# EAGLE design pc_OpenOx-ESP32_v1.1 (EAGLE 9.5.2)
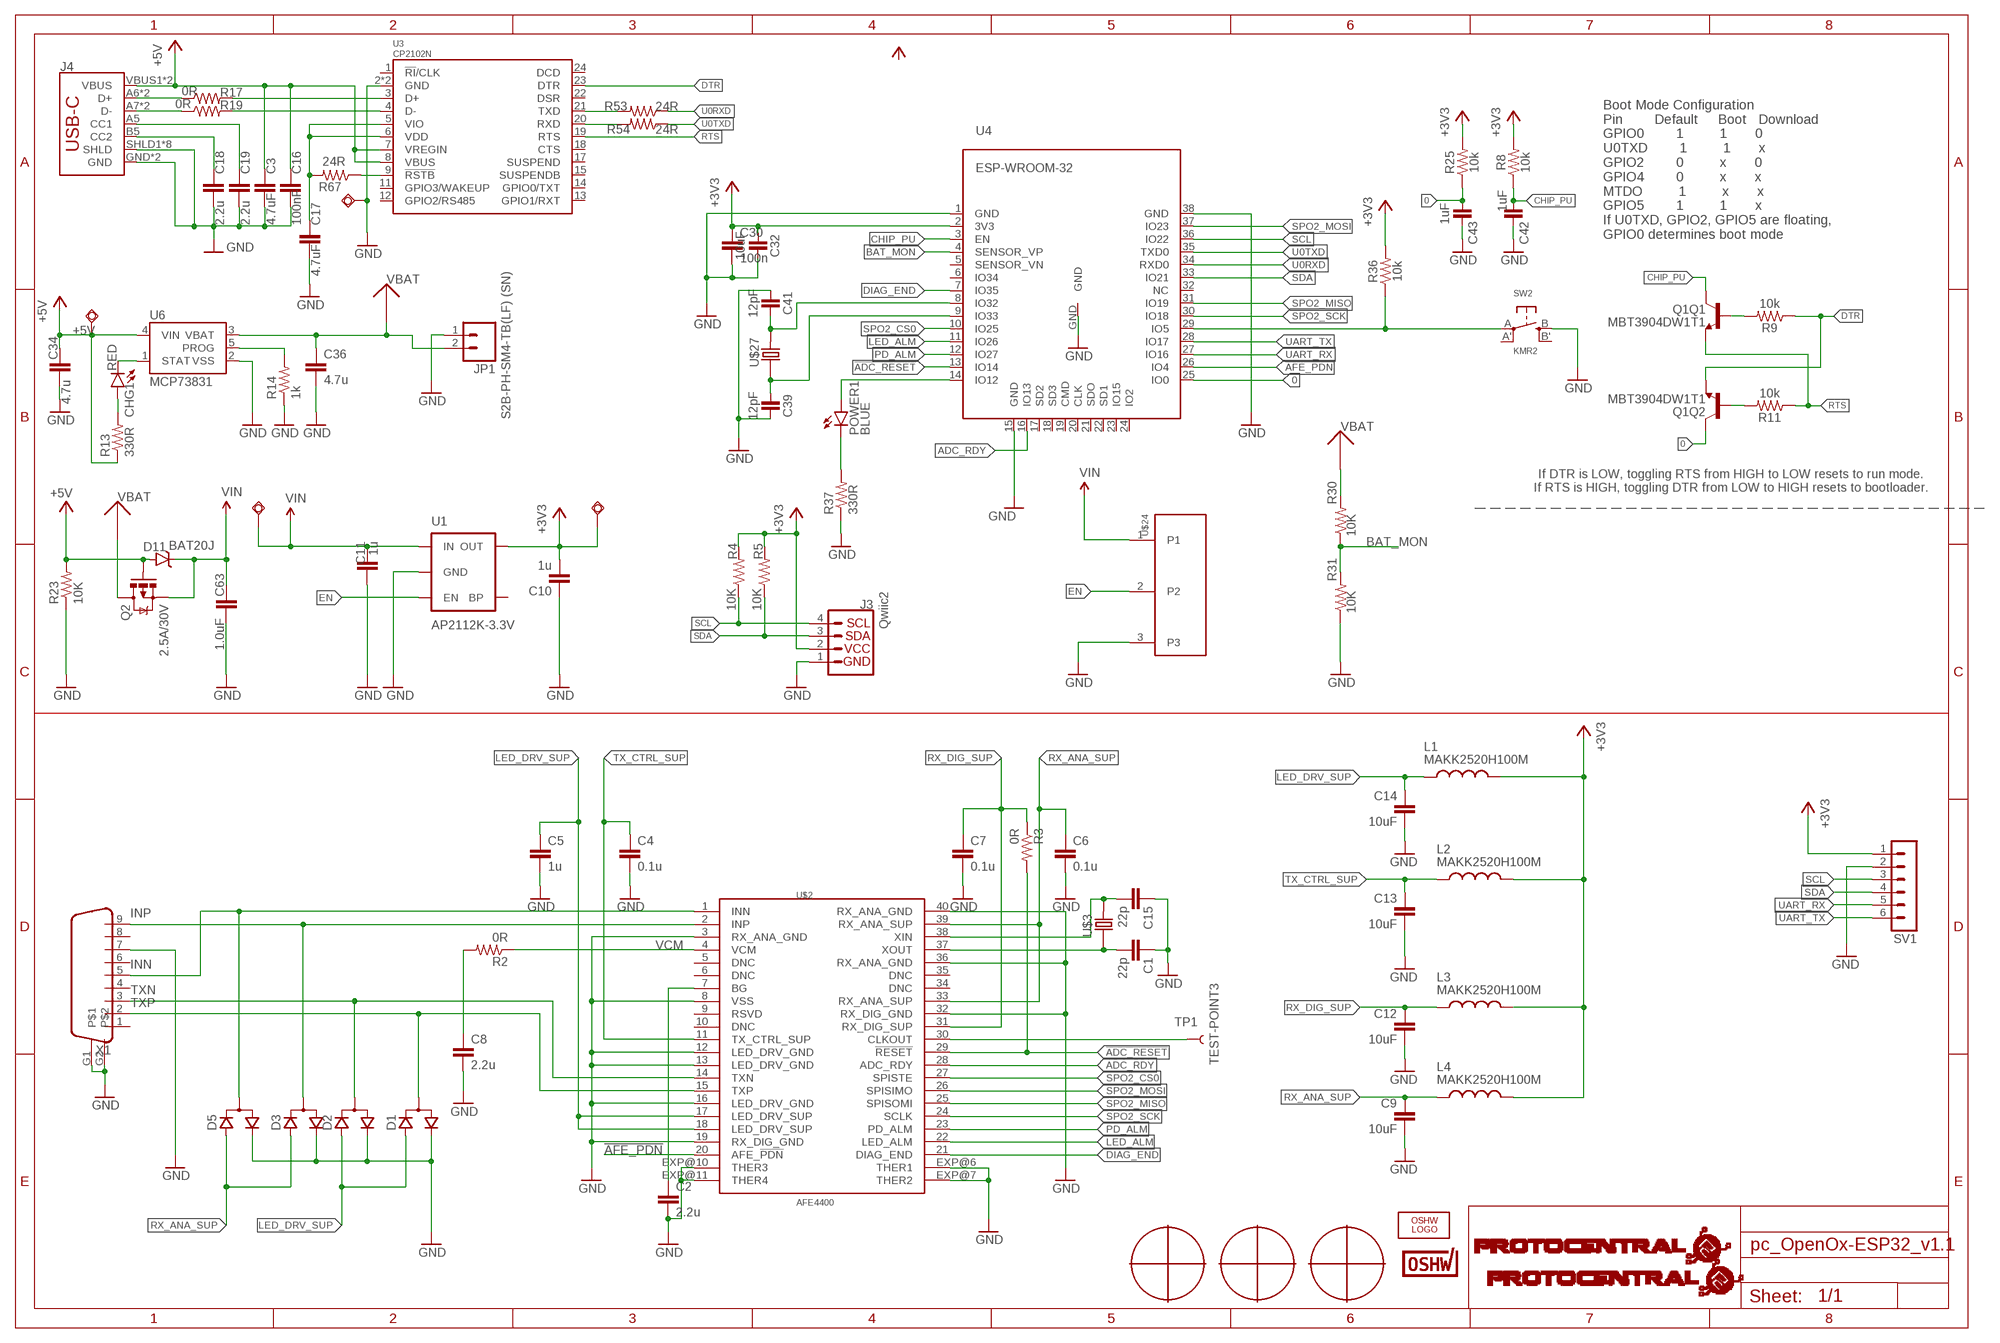
[diagram p0: schematic, sheet 1]

## Parts
C1  22p  C-EUC0402  [C0402]
C2  2.2u  C-EUC0402  [C0402]
C3  4.7uF  C-EUC0402  [C0402]
C4  0.1u  C-EUC0805  [C0805]
C5  1u  C-EUC0805  [C0805]
C6  0.1u  C-EUC0805  [C0805]
C7  0.1u  C-EUC0805  [C0805]
C8  2.2u  C-EUC0402  [C0402]
C9  10uF  C-EUC0805  [C0805]
C10  1u  C-EUC0805  [C0805]
C11  1u  C-EUC0805  [C0805]
C12  10uF  C-EUC0805  [C0805]
C13  10uF  C-EUC0805  [C0805]
C14  10uF  C-EUC0805  [C0805]
C15  22p  C-EUC0402  [C0402]
C16  100nF  C-EUC0402  [C0402]
C17  4.7uF  C-EUC0402  [C0402]
C18  2.2u  C-EUC0402  [C0402]
C19  2.2u  C-EUC0402  [C0402]
C30  100n  C-EUC0805  [C0805]
C32  10uF  CAPACITORS-0805  [C0805]
C34  4.7u  C-EUC0805  [C0805]
C36  4.7u  C-EUC0805  [C0805]
C39  12pF  CAPACITORS-0402  [C0402]
C41  12pF  CAPACITORS-0402  [C0402]
C42  1uF  CAPACITORS-0402  [C0402]
C43  1uF  CAPACITORS-0402  [C0402]
C63  1.0uF  C-EUC0402  [C0402]
CHG1  RED  LEDCHIPLED_0603  [CHIPLED_0603]
D1  D_ACACSOT323  [SOT323]
D2  D_ACACSOT323  [SOT323]
D3  D_ACACSOT323  [SOT323]
D5  D_ACACSOT323  [SOT323]
D11  BAT20J  DIODE-SCHOTTKY-BAT20J  [SOD-323]
J3  Qwiic2  QWIIC_CONNECTORJS-1MM  [1X04_1MM_RA]
J4  USB_C2-LAYER  [USB-C-16P]
JP1  S2B-PH-SM4-TB(LF) (SN)  M02-JST-2MM-SMT  [JST-2-SMD]
L1  MAKK2520H100M  [INDC2520X100N]
L2  MAKK2520H100M  [INDC2520X100N]
L3  MAKK2520H100M  [INDC2520X100N]
L4  MAKK2520H100M  [INDC2520X100N]
LOGO2  OSHW_LOGO_FILLX0200-NT  [OSHW_FILLX200_NOTEXT]
POWER1  BLUE  LEDCHIPLED_0603  [CHIPLED_0603]
Q1  MBT3904DW1T1  [SC70-6]
Q2  2.5A/30V  MOSFET-PCHANNELDMG2307L  [SOT23-3]
R2  0R  R-US_R0402  [R0402]
R3  0R  R-US_R0805  [R0805]
R4  10K  R-US_R0402  [R0402]
R5  10K  R-US_R0402  [R0402]
R8  10k  10KOHM-1/10W-1%(0603)0603  [0603]
R9  10k  10KOHM-0603-1/10W-1%  [0603]
R11  10k  10KOHM-0603-1/10W-1%  [0603]
R13  330R  R-US_R0402  [R0402]
R14  1k  R-US_R0402  [R0402]
R17  0R  R-US_R0402  [R0402]
R19  0R  R-US_R0402  [R0402]
R23  10K  R-US_R0402  [R0402]
R25  10k  10KOHM-1/10W-1%(0603)0603  [0603]
R30  10K  R-US_R0402  [R0402]
R31  10K  R-US_R0402  [R0402]
R36  10k  10KOHM-1/10W-1%(0603)0603  [0603]
R37  330R  R-US_R0402  [R0402]
R53  24R  R-US_R0402  [R0402]
R54  24R  R-US_R0402  [R0402]
R67  24R  R-US_R0402  [R0402]
SV1  MA06-1  [MA06-1]
SW2  KMR2  SWITCH_TACT_SMT4.6X2.8  [BTN_KMR2_4.6X2.8]
SWIO1  TPSQTP13R  [TP13R]
SWIO2  TPSQTP13R  [TP13R]
SWIO3  TPSQTP13R  [TP13R]
SWIO17  TPSQTP13R  [TP13R]
TP1  TEST-POINT3  [PAD.03X.03]
U1  AP2112K-3.3V  V_REG_LDOSMD  [SOT23-5]
U3  CP2102N  [QFN24]
U4  ESP-WROOM-32  [ESP-WROOM-32]
U6  MCP73831  [SOT23-5]
U$2  AFE4400  [QFN-40]
U$3  ABM3  [ABM3]
U$4  PROTY_LOGO_WITH_TEXT  [PROTY_WITH_TEXT]
U$5  PROTY-LOGO  [LOGO-PROTY]
U$7  CERT-SMALL  [CERT-SMALL-SILK]
U$24  JS102011SCQN  [JS102011SCQN]
U$27  520-327-12.5-34B(32.768KHZ)  ECS-X-34B  [ECX-31B]
U$33  FUDCIALPOINTS  [FIDUCIALPOINTS]
U$34  FUDCIALPOINTS  [FIDUCIALPOINTS]
U$35  FUDCIALPOINTS  [FIDUCIALPOINTS]
X1  DB9  [DB9]

## Nets
0: C43.1 Q1.6(Q2:C) R25.1 U4.25(IO0)
3.3V: C17.1 R67.2 U3.5(VIO) U3.6(VDD)
!ADC_RESET: R3.2 U4.13(IO14) U$2.29(!RESET)
!AFE_PDN: U4.26(IO4) U$2.20(AFE_!PDN)
+3V3: C10.2 C30.1 C32.1 J3.2 L1.2 L2.2 L3.2 L4.2 R4.2 R5.2 R8.2 R25.2 R36.2 SV1.1 SWIO1.TP U1.5(OUT) U4.2(3V3)
+5V: C3.1 C16.1 C34.1 D11.A J4.VBUS1(VBUS) J4.VBUS2(VBUS) Q2.1(G) R13.1 R23.2 SWIO3.TP U3.7(VREGIN) U3.8(VBUS) U6.4(VIN)
ADC_RDY: U4.16(IO13) U$2.28(ADC_RDY)
BAT_MON: R30.1 R31.2 U4.4(SENSOR_VP)
CHIP_PU: C42.1 Q1.3(Q1:C) R8.1 U4.3(EN)
DIAG_END: U4.7(IO35) U$2.21(DIAG_END)
DTR: Q1.1(Q2:E) R9.1 U3.23(DTR)
EN: U1.3(EN) U$24.2
GND: C1.1 C2.2 C3.2 C4.2 C5.2 C6.2 C7.2 C8.2 C9.2 C10.1 C11.1 C12.2 C13.2 C14.2 C15.1 C16.2 C17.2 C18.2 C19.2 C30.2 C32.2 C34.2 C36.2 C39.2 C41.1 C42.2 C43.2 C63.2 D1.2(C) D2.2(C) D3.2(C) D5.2(C) J3.1 J4.GND J4.GND2(GND) J4.SHLD1(SHLD) J4.SHLD2(SHLD) J4.SHLD3(SHLD) J4.SHLD4(SHLD) J4.SHLD5(SHLD) J4.SHLD6(SHLD) J4.SHLD7(SHLD) J4.SHLD8(SHLD) JP1.1 R14.1 R23.1 R31.1 R37.1 SV1.2 SW2.B(S) SWIO17.TP U1.2(GND) U3.2(GND) U3.PAD(GND) U4.1(GND) U4.15(GND) U4.38(GND) U4.GND U6.2(VSS) U$2.3(RX_ANA_GND) U$2.8(VSS) U$2.12(LED_DRV_GND) U$2.13(LED_DRV_GND) U$2.16(LED_DRV_GND) U$2.19(RX_DIG_GND) U$2.32(RX_DIG_GND) U$2.36(RX_ANA_GND) U$2.40(RX_ANA_GND) U$2.EXP@6(THER1) U$2.EXP@7(THER2) U$2.EXP@10(THER3) U$2.EXP@11(THER4) U$24.3 X1.7 X1.G1 X1.G2
INN: D5.1(CA) U$2.1(INN) X1.5
INP: D3.1(CA) U$2.2(INP) X1.9
LED_ALM: U4.11(IO26) U$2.22(LED_ALM)
LED_DRV_SUP: C5.1 C14.1 D1.3(A) D2.3(A) L1.1 U$2.17(LED_DRV_SUP) U$2.18(LED_DRV_SUP)
N$1: C1.2 U$2.37(XOUT) U$3.1
N$2: R67.1 U3.9(!RSTB)
N$3: C8.1 R2.2
N$4: C19.1 J4.A5(CC1)
N$5: C18.1 J4.B5(CC2)
N$6: R17.2 U3.3(D+)
N$7: R19.2 U3.4(D-)
N$9: J4.A6(D+) J4.B6(D+) R17.1
N$16: C15.2 U$2.38(XIN) U$3.2
N$20: C2.1 U$2.7(BG)
N$21: J4.A7(D-) J4.B7(D-) R19.1
N$22: TP1.P$1 U$2.30(CLKOUT)
N$92: Q1.5(Q1:B) R9.2
N$93: Q1.2(Q2:B) R11.2
N$96: CHG1.C U6.1(STAT)
N$97: CHG1.A R13.2
N$98: R14.2 U6.5(PROG)
N$99: C41.2 U4.8(IO32) U$27.P$2
N$100: C39.1 U4.9(IO33) U$27.P$1
N$101: R36.1 SW2.A(P) U4.29(IO5)
N$103: POWER1.A U4.14(IO12)
N$105: POWER1.C R37.2
PD_ALM: U4.12(IO27) U$2.23(PD_ALM)
RTS: Q1.4(Q1:E) R11.1 U3.19(RTS)
RX: R54.2 U3.20(RXD)
RX_ANA_SUP: C6.1 C9.1 D3.3(A) D5.3(A) L4.1 U$2.33(RX_ANA_SUP) U$2.39(RX_ANA_SUP)
RX_DIG_SUP: C7.1 C12.1 L3.1 R3.1 U$2.31(RX_DIG_SUP)
SCL: J3.4 R4.1 SV1.3 U4.36(IO22)
SDA: J3.3 R5.1 SV1.4 U4.33(IO21)
SPO2_CS0: U4.10(IO25) U$2.27(SPISTE)
SPO2_MISO: U4.31(IO19) U$2.25(SPISOMI)
SPO2_MOSI: U4.37(IO23) U$2.26(SPISIMO)
SPO2_SCK: U4.30(IO18) U$2.24(SCLK)
TX: R53.2 U3.21(TXD)
TX_CTRL_SUP: C4.1 C13.1 L2.1 U$2.11(TX_CTRL_SUP)
TXN: D2.1(CA) U$2.14(TXN) X1.3
TXP: D1.1(CA) U$2.15(TXP) X1.2
U0RXD: R53.1 U4.34(RXD0)
U0TXD: R54.1 U4.35(TXD0)
UART_RX: SV1.5 U4.27(IO16)
UART_TX: SV1.6 U4.28(IO17)
VBAT: C36.1 JP1.2 Q2.3(D) R30.2 U6.3(VBAT)
VCM: R2.1 U$2.4(VCM)
VIN: C11.2 C63.1 D11.C Q2.2(S) SWIO2.TP U1.1(IN) U$24.1
Unconnected: SW2.A'(P1) SW2.B'(S1) U1.4(BP) U3.1(!RI!/CLK) U3.11(GPIO3/WAKEUP) U3.12(GPIO2/RS485) U3.13(GPIO1/RXT) U3.14(GPIO0/TXT) U3.15(SUSPENDB) U3.17(SUSPEND) U3.18(CTS) U3.22(DSR) U3.24(DCD) U4.5(SENSOR_VN) U4.6(IO34) U4.17(SD2) U4.18(SD3) U4.19(CMD) U4.20(CLK) U4.21(SDO) U4.22(SD1) U4.23(IO15) U4.24(IO2) U4.32(NC) U$2.5(DNC) U$2.6(DNC) U$2.9(RSVD) U$2.10(DNC) U$2.34(DNC) U$2.35(DNC) X1.1 X1.4 X1.6 X1.8

## Notes on the sheet
- Boot Mode Configuration
  Pin        Default     Boot   Download
  GPIO0        1         1       0
  U0TXD        1         1       x
  GPIO2        0         x       0
  GPIO4        0         x       x
  MTDO         1         x       x
  GPIO5        1         1       x
  If U0TXD, GPIO2, GPIO5 are floating, 
  GPIO0 determines boot mode
- If DTR is LOW, toggling RTS from HIGH to LOW resets to run mode.
  If RTS is HIGH, toggling DTR from LOW to HIGH resets to bootloader.

## Library data of the parts
C1-C19 C30 C34 C36 C63 = rcl:C-EU: CAPACITOR, European symbol; SPICEPREFIX: C
C32 C39 C41-C43 = Arduino:CAPACITORS: Capacitors ...4.7uF @ 6.3V -> 0402 ...10uF @ 16V -> 0603 ...22uF @ 25V -> 0805
CHG1 POWER1 = led:LED: LED OSRAM: - CHIPLED LG R971, LG N971, LY N971, LG Q971, LY Q971, LO R971, LY R971 LH N974, LH R974 LS Q976, LO Q976, LY Q976 LO Q996 - Hyper CHIPLED LW Q18S LB Q993, LB Q99A, LB R99A - SideLED LS A670, LO A670, LY A670, LG A670, LP A670 LB A673, LV A673, LT A673, LW A673 LH A674 LY A675 LS A676, LA A676, LO A676, LY A676, LW A676 LS A679, LY A679, LG A679 - Hyper Micro SIDELED® LS Y876, LA Y876, LO Y876, LY Y876 LT Y87S - SmartLED LW L88C, LW L88S LB L89C, LB L89S, LG L890 LS L89K, LO L89K, LY L89K LS L896, LA L896, LO L896, LY L896 - TOPLED LS T670, LO T670, LY T670, LG T670, LP T670 LSG T670, LSP T670, LSY T670, LOP T670, LYG T670 LG T671, LOG T671, LSG T671 LB T673, LV T673, LT T673, LW T673 LH T674 LS T676, LA T676, LO T676, LY T676, LB T676, LH T676, LSB T676, LW T676 LB T67C, LV T67C, LT T67C, LS T67K, LO T67K, LY T67K, LW E67C LS E67B, LA E67B, LO E67B, LY E67B, LB E67C, LV E67C, LT E67C LW T67C LS T679, LY T679, LG T679 LS T770, LO T770, LY T770, LG T770, LP T770 LB T773, LV T773, LT T773, LW T773 LH T774 LS E675, LA E675, LY E675, LS T675 LS T776, LA T776, LO T776, LY T776, LB T776 LHGB T686 LT T68C, LB T68C - Hyper Mini TOPLED® LB M676 - Mini TOPLED Santana® LG M470 LS M47K, LO M47K, LY M47K Source: http://www.osram.convergy.de LUXEON: - LUMILED® LXK2-PW12-R00, LXK2-PW12-S00, LXK2-PW14-U00, LXK2-PW14-V00 LXK2-PM12-R00, LXK2-PM12-S00, LXK2-PM14-U00 LXK2-PE12-Q00, LXK2-PE12-R00, LXK2-PE12-S00, LXK2-PE14-T00, LXK2-PE14-U00 LXK2-PB12-K00, LXK2-PB12-L00, LXK2-PB12-M00, LXK2-PB14-N00, LXK2-PB14-P00, LXK2-PB14-Q00 LXK2-PR12-L00, LXK2-PR12-M00, LXK2-PR14-Q00, LXK2-PR14-R00 LXK2-PD12-Q00, LXK2-PD12-R00, LXK2-PD12-S00 LXK2-PH12-R00, LXK2-PH12-S00 LXK2-PL12-P00, LXK2-PL12-Q00, LXK2-PL12-R00 Source: www.luxeon.com KINGBRIGHT: KA-3528ASYC Source: www.kingbright.com
D1-D3 D5 = zetex:D_ACAC: Dual DIODE; OC_FARNELL: unknown; OC_NEWARK: unknown
D11 = SparkFun-DiscreteSemi:DIODE-SCHOTTKY: Schottky diodes in SFE's production catalog BAT20J 1A 23V 0.62Vf RB751 120mA 40V 0.37Vf PMEG4005EJ 0.5A 40V 0.42Vf MBRA140 1A 40V 0.5Vf B340A 3A 40V SMA; PROD_ID: DIO-11623
J3 = SparkFun-Connectors:QWIIC_CONNECTOR: SparkFun I2C Standard Qwiic Connector An SMD 1mm pitch JST connector makes it easy and quick (get it? Qwiic?) to connect I2C devices to each other. The Qwiic system <http://www.sparkfun.com/qwiic> enables fast and solderless connection between popular platforms and various sensors and actuators. We carry 200mm <https://www.sparkfun.com/products/14204>, 100mm <https://www.sparkfun.com/products/14205>, 50mm <https://www.sparkfun.com/products/14206>, and breadboard friendly <https://www.sparkfun.com/products/14207> Qwiic cables. We also offer 10 pcs strips <https://www.sparkfun.com/products/14323> the SMD connectors.; PROD_ID: CONN-13694
J4 = SparkFun-Connectors:USB_C: USB Type C 16Pin Connector Super Speed pins not available on the 16-pin purely SMD connector so this part is best for USB 2.0 implementations. D1 and D2 are tied together enabling D+/- no matter which way the cable is plugged into the connector. The two channel configuration pins (CC1/2) are exposed. These are normally connected to ground via 5.1k resistors but can be reconfigured for high current/high power applications.; PROD_ID: CONN-14122
JP1 = SparkFun:M02: Header 2 Standard 2-pin 0.1" header. Use with straight break away headers (SKU : PRT-00116), right angle break away headers (PRT-00553), swiss pins (PRT-00743), machine pins (PRT-00117), and female headers (PRT-00115). Molex polarized connector foot print use with SKU : PRT-08233 with associated crimp pins and housings.
L1-L4 = circuitects:MAKK2520H100M: INDUCTOR, METAL WIRE-W CHIP, 1008, 10 UH 20%, SMD Check prices <https://pricing.snapeda.com/parts/MAKK2520H100M/Taiyo%20Yuden/view-part?ref=eda>; AVAILABILITY: In Stock; DESCRIPTION: 10µH Shielded Wirewound Inductor 750mA 650mOhm Max 1008 (2520 Metric); MF: Taiyo Yuden; MP: MAKK2520H100M; PACKAGE: 2520 Taiyo Yuden; PRICE: None
LOGO2 = ohw-logo:OSHW_LOGO_FILL
Q1 = esp32-thing-temp:MBT3904DW1T1: MBT3904DW1 Dual NPN Transistors The MBT3904W1 puts two general purpose 3904 NPN transistors in a single package. Datasheet <http://www.onsemi.com/pub_link/Collateral/MBT3904DW1T1-D.PDF>; PROD_ID: TRANS-13337
Q2 = SparkFun-DiscreteSemi:MOSFET-PCHANNEL: Generic PMOSFET IRLML2244 - TRANS-11153 (SOT-23 -20V -4.3A) (1.Gate 2.Source 3.Drain) FQP27P06 - COM-10349 <http://www.sparkfun.com/products/10349> (TO-220 -60V -27A) (1.Gate 2.Source 3.Drain); PROD_ID: TRANS-11308
R2-R5 R13 R14 R17 R19 R23 R30 R31 R37 R53 R54 R67 = rcl:R-US_: RESISTOR, American symbol; SPICEPREFIX: R
R8 R25 R36 = SparkFun-Resistors:10KOHM-1/10W-1%(0603): RES-00824; PROD_ID: RES-00824; VALUE: 10K
R9 R11 = SparkFun-Resistors:10KOHM: 10kΩ resistor A resistor is a passive two-terminal electrical component that implements electrical resistance as a circuit element. Resistors act to reduce current flow, and, at the same time, act to lower voltage levels within circuits. - Wikipedia; PROD_ID: RES-00824
SV1 = con-lstb:MA06-1: PIN HEADER; OC_FARNELL: unknown; OC_NEWARK: unknown
SW2 = microbuilder:SWITCH_TACT_SMT: SMT Tact Switches 6x6mm - Digikey: P12940SCT-ND KMR2 (4.6x2.8mm) - Digikey: 401-1426-1-ND EVQ-PQHB55 - Light Touch, 160GF (4.5x4.5mm) - Digikey: P8090SCT-ND KMT0 - KMT021 NGJ LHS (etc.) IP68/Waterproof - Digikey: CKN10289CT-ND
SWIO1-SWIO3 SWIO17 = testpad:TPSQ: Test pad
TP1 = SparkFun:TEST-POINT
U1 = SparkFun-PowerIC:V_REG_LDO: Voltage Regulator LDO Standard 150mA LDO voltage regulator in SOT-23 layout. Micrel part MIC5205. BP (by-pass) pin is used to lower output noise with 470pF cap.; PROD_ID: VREG-12457
U3 = SparkFun-IC-Comms:CP2102N; PROD_ID: IC-14020
U4 = esp32:ESP-WROOM-32
U6 = SparkFun:MCP73831: Microchip's MCP73831 Miniature single cell, fully integrated Li-Ion, Li-polymer charge management controller http://ww1.microchip.com/downloads/en/DeviceDoc/21984a.pdf
U$2 = circuitects:AFE4400
U$3 = circuitects:ABM3
U$4 = circuitects:PROTY_LOGO_WITH_TEXT
U$5 = circuitects:PROTY-LOGO
U$7 = OSHWA:CERT
U$24 = circuitects:JS102011SCQN
U$27 = circuitects:ECS-X-34B
U$33-U$35 = circuitects:FUDCIALPOINTS
X1 = circuitects:DB9: DB9 Connector Standard DB9 (D-Sub 9) serial connector. Can be used for CAN bus as well as RS485 and RS232. Footprint production proven. Spark Fun Electronics SKU : PRT-00429

## Net classes
2 gnd: width 0.102 mm, drill 0.1 mm
4 USBpair: width 0.102 mm, drill 0.1 mm, clearance 0.15 mm to class 3

## Board
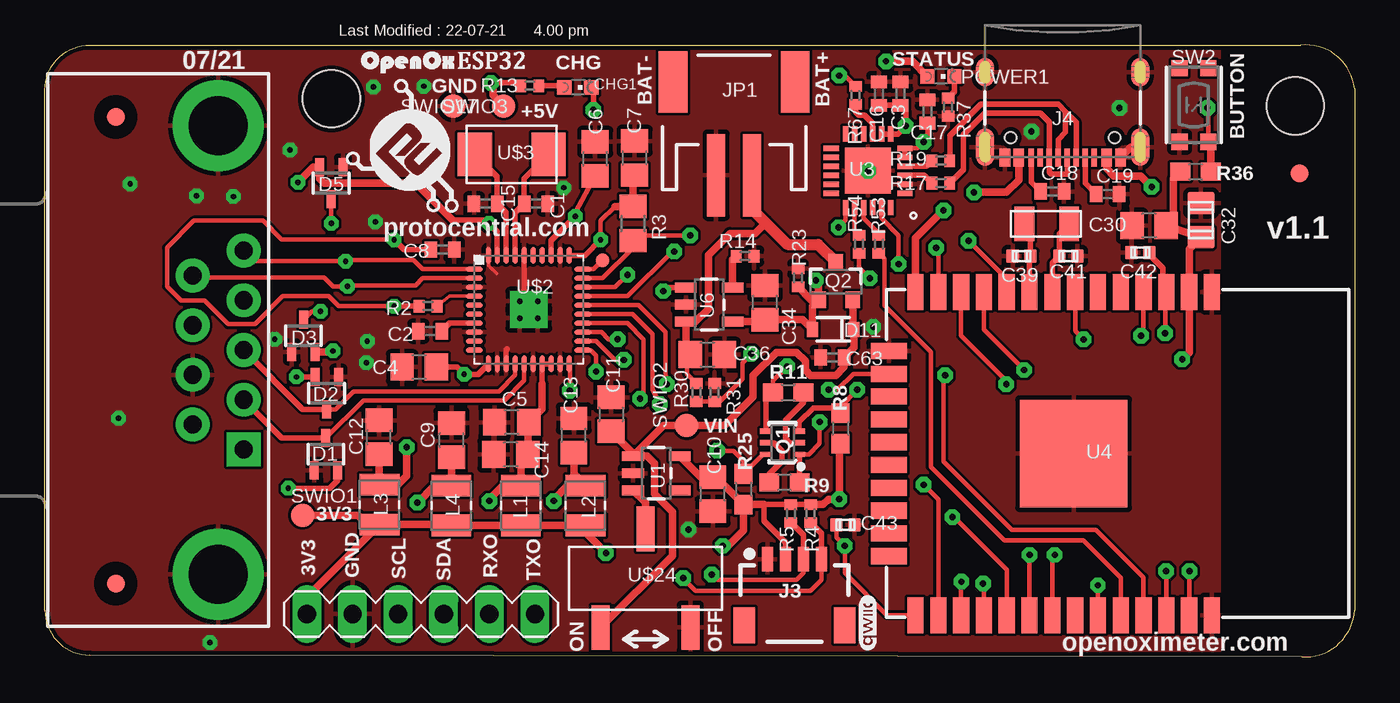
[diagram p1: board, top side]
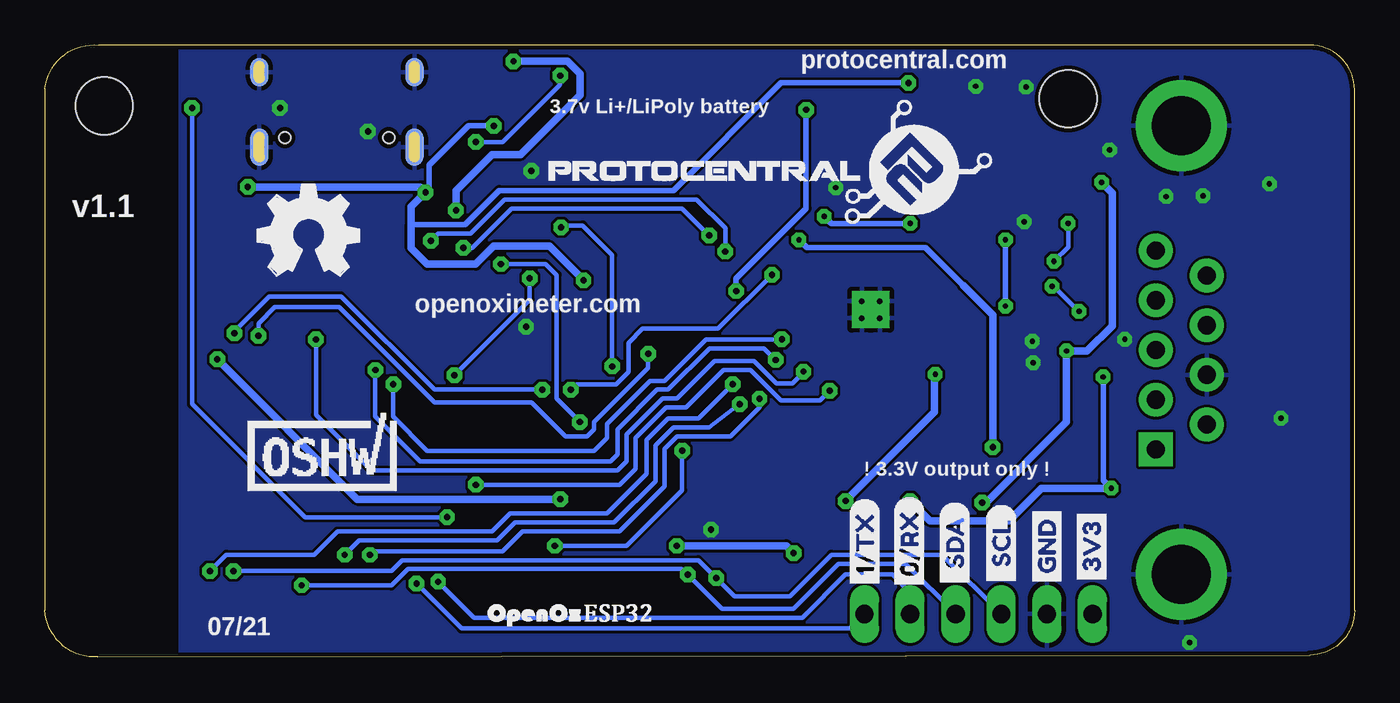
[diagram p2: board, bottom side, seen from below]

Size 72.95 x 34.11 mm. Coordinates in mm from the lower left corner, seen from the top.
Outline: 2.5,34.09 69.95,34.09 arc-90 72.95,31.65 72.95,2.6 arc-90 70,0 2.5,0.1 arc-90 0,2.6 0,31.6 arc-90 2.5,34.09
Copper layers (1*2*15*16): Top 0.035mm / dielectric 1.5mm / Route2 0.035mm / dielectric 0.15mm / Route15 0.035mm / dielectric 0.2mm / Bottom 0.035mm
Design rules "Circuitects-Rules": minimum track width 6mil, minimum drill 0.3mm, track to track 6mil, track to pad 6mil, pad to pad 6mil, via to via 6mil, smd to smd 6mil, copper to edge 10mil, drill to drill 8mil, minimum pad ring 12mil, minimum via ring 10mil, stop-mask expansion 4mil, vias tented up to drill 25mil, thermal gap 10mil
Holes 3.2 mm at 15.95,31.1 69.65,30.7

### Footprints (pad centres in the part's own frame; a part is rotated, then mirrored left to right if it is on the bottom)
C0402 = smd 0.7 x 0.9: 1 -0.65,0; 2 0.65,0
C0805 = smd 1.3 x 1.5: 1 -0.95,0; 2 0.95,0
C0805' = smd 1.5 x 1.25: 1 0,0.95; 2 0,-0.95
C0402' = smd 0.75 x 0.7: 1 0,0.5; 2 0,-0.5
CHIPLED_0603 = smd 0.8 x 0.8: A 0,-0.75; C 0,0.75
SOT323 = smd 0.5 x 1: 1 0,0.9; 2 -0.65,-0.9; 3 0.65,-0.9
SOD-323 = smd 0.63 x 0.83: A 1.15,0; C -1.15,0
1X04_1MM_RA = smd 0.6 x 1.35: 1 -1.5,0; 2 -0.5,0; 3 0.5,0; 4 1.5,0 | smd 1.2 x 2: NC1 2.8,-3.675; NC2 -2.8,-3.675
USB-C-16P = smd 0.3 x 1: A5 -1.25,-0.34; A6 -0.25,-0.34; A7 0.25,-0.34; A8 1.25,-0.34; B5 1.75,-0.34; B6 0.75,-0.34; B7 -0.75,-0.34; B8 -1.75,-0.34 | smd 0.6 x 1: GND -3.225,-0.34; GND2 3.225,-0.34; VBUS1 -2.45,-0.34; VBUS2 2.45,-0.34 | smd 1 x 2.1: SHLD1 -4.32,-0.915; SHLD2 4.32,-0.915 | smd 1 x 2.1 bottom: SHLD3 -4.32,-0.915; SHLD4 4.32,-0.915 | smd 1 x 1.6: SHLD5 -4.32,-5.095; SHLD8 4.32,-5.095 | smd 1 x 1.6 bottom: SHLD6 -4.32,-5.095; SHLD7 4.32,-5.095 | hole 0.65: -2.89,-1.445; 2.89,-1.445
JST-2-SMD = smd 1 x 4.6: 1 -1,-3.7; 2 1,-3.7 | smd 1.6 x 3.4: NC1 -3.4,1.5; NC2 3.4,1.5
INDC2520X100N = smd 1.2 x 2.22: 1 -1.11,0; 2 1.11,0
SC70-6 = smd 0.3 x 0.66: 1 -0.65,-0.92; 2 0,-0.92; 3 0.65,-0.92; 4 0.65,0.92; 5 0,0.92; 6 -0.65,0.92
SOT23-3 = smd 0.8 x 0.9: 1 -0.95,-1; 2 0.95,-1; 3 0,1.1
R0402 = smd 0.6 x 0.7: 1 -0.5,0; 2 0.5,0
R0805 = smd 1.3 x 1.5: 1 -0.95,0; 2 0.95,0
0603 = smd 1.1 x 1: 1 -0.85,0; 2 0.85,0
MA06-1 = drill 1.016 long: 1 -6.35,0; 2 -3.81,0; 3 -1.27,0; 4 1.27,0; 5 3.81,0; 6 6.35,0
BTN_KMR2_4.6X2.8 = smd 0.9 x 0.9: A 2.05,0.8; A' -2.05,0.8; B 2.05,-0.8; B' -2.05,-0.8
TP13R = smd 1.3 x 1.3: TP 0,0
PAD.03X.03 = smd 0.762 x 0.762: P$1 0,0
SOT23-5 = smd 0.55 x 1.2: 1 -0.95,-1.3; 2 0,-1.3; 3 0.95,-1.3; 4 0.95,1.3; 5 -0.95,1.3
QFN24 = smd 0.85 x 0.3: 1 -2.05,1.25; 2 -2.05,0.75; 3 -2.05,0.25; 4 -2.05,-0.25; 5 -2.05,-0.75; 6 -2.05,-1.25; 13 2.05,-1.25; 14 2.05,-0.75; 15 2.05,-0.25; 16 2.05,0.25; 17 2.05,0.75; 18 2.05,1.25 | smd 0.3 x 0.85: 7 -1.25,-2.05; 8 -0.75,-2.05; 9 -0.25,-2.05; 10 0.25,-2.05; 11 0.75,-2.05; 12 1.25,-2.05; 19 1.25,2.05; 20 0.75,2.05; 21 0.25,2.05; 22 -0.25,2.05; 23 -0.75,2.05; 24 -1.25,2.05 | smd 2.55 x 2.55: PAD 0,0
ESP-WROOM-32 = smd 0.9 x 2: 1 7.7,9; 2 6.43,9; 3 5.16,9; 4 3.89,9; 5 2.62,9; 6 1.35,9; 7 0.08,9; 8 -1.19,9; 9 -2.46,9; 10 -3.73,9; 11 -5,9; 12 -6.27,9; 13 -7.54,9; 14 -8.81,9; 25 -8.81,-9; 26 -7.54,-9; 27 -6.27,-9; 28 -5,-9; 29 -3.73,-9; 30 -2.46,-9; 31 -1.19,-9; 32 0.08,-9; 33 1.35,-9; 34 2.62,-9; 35 3.89,-9; 36 5.16,-9; 37 6.43,-9; 38 7.7,-9 | smd 2 x 0.9: 15 -10.3,5.715; 16 -10.3,4.445; 17 -10.3,3.175; 18 -10.3,1.905; 19 -10.3,0.635; 20 -10.3,-0.635; 21 -10.3,-1.905; 22 -10.3,-3.175; 23 -10.3,-4.445; 24 -10.3,-5.715 | smd 6 x 6: GND 0,0
QFN-40 = smd 0.95 x 0.28: 1 -3.025,2.25; 2 -3.025,1.75; 3 -3.025,1.25; 4 -3.025,0.75; 5 -3.025,0.25; 6 -3.025,-0.25; 7 -3.025,-0.75; 8 -3.025,-1.25; 9 -3.025,-1.75; 10 -3.025,-2.25; 21 3.025,-2.25; 22 3.025,-1.75; 23 3.025,-1.25; 24 3.025,-0.75; 25 3.025,-0.25; 26 3.025,0.25; 27 3.025,0.75; 28 3.025,1.25; 29 3.025,1.75; 30 3.025,2.25 | smd 0.28 x 0.95: 11 -2.25,-3.025; 12 -1.75,-3.025; 13 -1.25,-3.025; 14 -0.75,-3.025; 15 -0.25,-3.025; 16 0.25,-3.025; 17 0.75,-3.025; 18 1.25,-3.025; 19 1.75,-3.025; 20 2.25,-3.025; 31 2.25,3.025; 32 1.75,3.025; 33 1.25,3.025; 34 0.75,3.025; 35 0.25,3.025; 36 -0.25,3.025; 37 -0.75,3.025; 38 -1.25,3.025; 39 -1.75,3.025; 40 -2.25,3.025 | drill 0.3 pad 1.1 square: EXP@6 -0.5,0.475; EXP@7 0.5,0.475; EXP@10 -0.5,-0.475; EXP@11 0.5,-0.475
ABM3 = smd 1.9 x 2.4: 1 -2.05,0; 2 2.05,0
JS102011SCQN = smd 1 x 2.5: 1 -2.5,-2.75; 2 0,2.75; 3 2.5,-2.75
ECX-31B = smd 1.1 x 1.9: P$1 1.25,0; P$2 -1.25,0
FIDUCIALPOINTS = smd 1 x 1: TP 0,0
DB9 = drill 1.016 pad 1.88 square: 1 -5.54,-1.42 | drill 1.016 pad 1.88: 2 -2.77,-1.42; 3 0,-1.42; 4 2.77,-1.42; 5 5.54,-1.42; 6 -4.15,1.42; 7 -1.38,1.42; 8 1.38,1.42; 9 4.15,1.42 | drill 3.302 pad 5.08: G1 -12.5,0; G2 12.5,0

### Placement (x,y rotation side)
C1  27.35,25.25 180 top
C2  21.45,18.15 180 top
C3  47.65,31.39 90 top
C4  20.85,16.15 180 top
C5  26,13.08 180 top
C6  30.65,27.75 90 top
C7  32.85,27.8 90 top
C8  22.15,22.7 0 top
C9  22.65,12.08 90 top
C10  37.2,9.07 90 top
C11  31.54,13.52 270 top
C12  18.61,12.24 90 top
C13  29.46,12.34 90 top
C14  25.95,11.28 180 top
C15  24.55,25.25 0 top
C16  46.45,31.39 90 top
C17  49.15,30.39 90 top
C18  56.11,25.94 0 top
C19  59.19,25.79 0 top
C30  61.5,24.04 180 top
C32  10uF  [C0805']  64.39,24.34 180 top
C34  40.11,19.75 90 top
C36  36.9,16.85 0 top
C39  12pF  [C0402']  54.4,22.34 270 top
C41  12pF  [C0402']  57,22.34 270 top
C42  1uF  [C0402']  61.02,22.53 270 top
C43  1uF  [C0402']  44.58,7.35 90 top
C63  43.86,16.69 180 top
CHG1  29.69,31.74 270 top
D1  15.65,11.3 0 top
D2  15.7,14.7 180 top
D3  14.4,17.9 0 top
D5  15.95,26.4 180 top
D11  43.9,18.25 180 top
J3  41.75,5.45 0 top
J4  56.69,27.49 180 top
JP1  38.39,30.54 0 top
L1  26.51,8.44 270 top
L2  30.11,8.44 270 top
L3  18.64,8.49 270 top
L4  22.64,8.44 270 top
LOGO2  61.1,21.25 0 bottom
LOGO4  QWIIC_LOGO_3MM  [QWIIC_3MM]  45.84,1.9 90 top
POWER1  49.91,32.35 270 top
Q1  41.09,11.94 90 top
Q2  44.05,20.9 0 top
R2  21.35,19.55 180 top
R3  32.75,24.15 270 top
R4  42.65,7.99 90 top
R5  41.55,7.99 90 top
R8  44.3,12.74 270 top
R9  41.19,9.74 180 top
R11  41.4,14.74 0 top
R13  27.01,31.82 0 top
R14  39,22.34 180 top
R17  49.9,26.4 180 top
R19  49.9,27.65 180 top
R23  41.95,21.13 270 top
R25  38.91,9.35 270 top
R30  36.29,14.74 90 top
R31  37.3,14.74 270 top
R36  64.09,27.04 180 top
R37  50.3,30.64 90 top
R53  46.45,22.99 90 top
R54  45.35,22.99 90 top
R67  45.15,31.29 90 top
SV1  20.95,2.39 0 top
SW2  64,30.75 270 top
SWIO1  14.35,7.89 0 top
SWIO2  35.75,12.89 0 top
SWIO3  25.55,30.69 0 top
SWIO17  22.75,30.69 0 top
TP1  31.05,22.1 0 top
U1  34.06,10.24 270 top
U3  45.85,27.09 180 top
U4  57.3,11.34 0 top
U6  37,19.64 270 top
U$2  26.95,19.35 0 top
U$3  26,28 180 top
U$4  44.9,24.5 0 bottom
U$5  23.15,24.7 90 top
U$6  [3V32]  14.65,3.82 90 bottom
U$7  57.5,9.25 0 bottom
U$8  [OPENOXLOGO1]  17.15,32.29 0 top
U$9  [_SCL16]  19.68,3.73 90 bottom
U$10  [_SDA17]  22.27,3.63 90 bottom
U$12  [OPENOXLOGO1]  48.75,1.49 0 bottom
U$13  [GND0]  17.14,3.75 90 bottom
U$16  PULSE  [PULSE]  49.6,5.95 0 bottom
U$24  33.45,4.39 0 top
U$27  55.8,24.14 180 top
U$33  3.95,30.09 0 top
U$34  69.88,26.95 0 top
U$35  3.95,4.09 0 top
U$44  [1#TX1]  27.28,3.62 90 bottom
U$48  [0#RX0]  24.8,3.57 90 bottom
X1  9.65,17.1 90 top

### Tracks (layer width: path | path; a pad name or v marks a point on that pad's centre or on a via)
0  (via drill 0.35)
  Top 0.254: Q1.6 40,11.29 R25.1 38.91,10.94 38.35,11.49 v37.45,11.49 | U4.25 46.91,2.34 44.55,4.69 v44.55,6.19 44.08,6.66 C43.1
  Bottom 0.254: v44.55,6.19 40.55,6.19 37.45,9.29 v37.45,11.49
3.3V  (via drill 0.35)
  Top 0.254: C17.1 49.15,28.89 v48.95,28.69 48.6,28.34 U3.6 | R67.2 44.55,32.39 v44.25,32.39
  Top 0.305: U3.5 U3.6 | 49.15,29.59 C17.1
  Bottom 0.254: v48.95,28.69 47.45,28.69 44.25,31.89 v44.25,32.39
!ADC_RESET  (via drill 0.35)
  Top 0.254: U$2.29 31.06,21.1 32.75,22.79 32.75,22.89 | 32.75,22.89 R3.2 | U4.13 49.76,22.68 v49.65,22.79 | v35.95,23.49 33.35,23.49 32.75,22.89
  Bottom 0.254: v49.65,22.79 49.15,22.79 46.95,24.99 37.45,24.99 v35.95,23.49
!AFE_PDN  (via drill 0.35)
  Top 0.254: U$2.20 29.24,16.29 v29.24,14.84 | U4.26 49.76,8.78 v48.95,9.59
  Bottom 0.254: v29.24,14.84 29.79,14.29 31.95,14.29 33.65,15.99 35.15,15.99 37.25,13.89 38.35,13.89 40.05,12.19 40.05,10.49 40.95,9.59 v48.95,9.59
+3V3  (via drill 0.35)
  Top 0.305: R4.2 R5.2 40.05,8.49 40.05,7.59 41.25,6.39 J3.2
  Top 0.406: 18.55,7.29 L3.2 22.59,7.38 L4.2 L1.2 L2.2 30.11,6.93 v31.25,5.79 | 18.55,7.29 14.6,3.34 SV1.1 | R36.2 62.85,26.65 62.85,24.43 C30.1 62.49,24 C32.1 63.73,22.73 U4.2 63.73,16.98 v63.35,16.59 | R4.2 43.35,8.49 43.65,8.79 v44.25,8.79 44.25,11.83 R8.2 | R25.2 40.05,8.5 40.05,8.49 | U1.5 36.53,10.02 C10.2 37.38,10.02 R25.2 | R25.2 38.91,7.05 38.05,6.19 v37.75,6.19 | SWIO1.TP 17.45,7.89 18.05,7.29 18.55,7.29
  Bottom 0.406: v63.35,16.59 55.55,8.79 v44.25,8.79 | v37.75,6.19 31.65,6.19 v31.25,5.79
+5V  (via drill 0.35)
  Top 0.305: C16.1 C3.1 47.95,30.44 v47.95,29.59 47.5,29.14 U3.7 U3.8 | v24.85,31.99 24.95,31.99 26.34,31.99 R13.1
  Top 0.406: U6.4 40,18.69 C34.1 42.21,18.8 D11.A 42.75,19.55 Q2.1 | J4.VBUS2 54.24,26.58 53.55,25.89 v51.75,25.89 | J4.VBUS1 59.14,27.2 59.54,26.8 60.34,26.8 60.34,26.79 61.05,26.79 v61.65,26.19 | Q2.1 42.68,19.9 R23.2 | Q2.1 43.1,20.84 v42.95,20.99 | SWIO3.TP 24.95,31.29 24.95,31.99
  Bottom 0.305: v51.75,25.89 51.55,26.09 51.55,27.39 49.35,29.59 v47.95,29.59 | 52.55,24.09 49.55,24.09 47.65,25.99 37.95,25.99 31.95,31.99 v24.85,31.99
  Bottom 0.406: v61.65,26.19 52.05,26.19 v51.75,25.89 52.55,25.09 52.55,24.09 52.55,22.79 51.65,21.89 48.95,21.89 47.95,22.89 44.85,22.89 v42.95,20.99
ADC_RDY  (via drill 0.35)
  Top 0.254: U$2.28 31.76,20.6 v32.45,21.29 | U4.16 45.04,15.78 44.15,14.89 v43.65,14.89
  Bottom 0.254: v43.65,14.89 43.35,15.19 41.15,15.19 40.45,15.89 40.45,17.49 39.65,18.29 35.45,18.29 v32.45,21.29
BAT_MON  (via drill 0.35)
  Top 0.254: U4.4 61.19,18.04 v61.05,17.89 | v39.35,16.89 38.85,16.39 38.85,15.49 37.59,14.24 R31.2 R30.1
  Bottom 0.254: v61.05,17.89 61.05,18.59 60.15,19.49 56.55,19.49 51.25,14.19 45.85,14.19 43.95,12.29 42.75,12.29 42.35,12.69 42.35,13.09 39.35,16.09 v39.35,16.89
CHIP_PU  (via drill 0.35)
  Top 0.254: R8.1 44.3,13.95 v45.25,14.89 | v62.4,18.04 62.4,20.27 U4.3
  Top 0.305: U4.3 62.26,20.54 62.26,21.68 61.39,22.55 C42.1 | R8.1 44,13.89 42.8,13.89 42.01,13.09 Q1.3
  Bottom 0.254: v45.25,14.89 51.25,14.89 56.45,20.09 60.45,20.09 62.45,18.09 v62.4,18.04
DIAG_END  (via drill 0.35)
  Top 0.254: v30.7,15.9 30.7,16.8 30.43,17.08 30,17.08 U$2.21 | U4.7 57.38,18.16 v57.85,17.69
  Bottom 0.254: v57.85,17.69 57.85,13.49 54.75,10.39 41.05,10.39 40.55,10.89 40.55,12.39 38.55,14.39 37.75,14.39 35.65,16.49 33.45,16.49 32.2,15.25 31.3,15.25 30.67,15.87 v30.7,15.9
DTR  (via drill 0.35)
  Top 0.254: Q1.1 42.55,11.29 43.15,11.89 v43.15,13.09 | v47.55,21.89 47.55,23.49 46.6,24.44 U3.23
  Top 0.305: Q1.1 42.04,11.26 R9.1
  Bottom 0.254: v43.15,13.09 44.45,14.39 44.45,21.29 45.05,21.89 v47.55,21.89
EN
  Top 0.406: U1.3 33.45,8.6 U$24.2
GND  (via drill 0.3, 0.35)
  Top 0.2: U$2.40 24.7,21.8 25.15,21.35
  Top 0.305: U$2.36 26.7,20.08 U$2.EXP@6 | U$2.13 25.7,17.1 25.75,17.15
  Top 0.406: J4.GND 60.49,28.41 J4.SHLD3
  Bottom 0.305: U$2.EXP@10 U$2.EXP@11 U$2.EXP@7 U$2.EXP@6
  other vias: 9.2,0.8 17.9,16.4 18.3,31.75 4.75,26.35 21.1,31.8 13.65,28.25 10.5,25.65 17.95,17.6 4.1,13.3 8.45,25.7 28.9,26.15 12.8,17.7 18.4,24.25 45.85,27.09 46.15,18.39 59.85,30.59 54.95,29.29 35.85,7.09
  pour Top: -0.05,0.09 65.45,0.09 65.45,34.09 -0.05,34.09
  pour Bottom: -0.05,0.09 65.45,0.09 65.45,34.09 -0.05,34.09
INN  (via drill 0.3)
  Top 0.254: D5.1 v15.95,24.15 | X1.5 11.66,22.05 v16.75,22.05 16.8,22.1 20.55,22.1 21.05,21.6 U$2.1
  Top 0.305: 16.71,22.09 v16.75,22.05
  Bottom 0.254: v15.95,24.15 15.95,22.85 v16.75,22.05
INP  (via drill 0.3)
  Top 0.254: v16.85,20.65 16.05,20.65 15.55,21.15 8.33,21.15 X1.9 | D3.1 14.85,19.25 v15.35,19.25 | U$2.2 21.05,21.1 20.65,20.7 16.9,20.7
  Top 0.305: 16.9,20.7 v16.85,20.65 16.79,20.71
  Bottom 0.254: v15.35,19.25 16.75,20.65 v16.85,20.65
LED_ALM  (via drill 0.35)
  Top 0.254: U$2.22 30.7,17.6 31.75,16.55 v32.25,16.55 | U4.11 52.3,18.24 v54.55,15.99
  Bottom 0.254: v54.55,15.99 54.55,13.39 52.05,10.89 41.45,10.89 41.05,11.29 41.05,12.69 38.85,14.89 38.25,14.89 35.94,17.2 32.9,17.2 v32.25,16.55
LED_DRV_SUP  (via drill 0.3, 0.35)
  Top 0.305: U$2.18 U$2.17 27.7,15.2 | D2.3 v14,15.6 | D1.3 16.3,9.85 15.85,9.4 v13.55,9.4
  Top 0.406: 27.7,15.2 27.7,13.83 C5.1 26.9,13.03 C14.1 26.51,10.89 L1.1 25.51,9.55 24.75,8.79 v24.75,8.69
  Bottom 0.305: v13.55,9.4 14,9.85 v14,15.6
  Bottom 0.406: v24.75,8.69 23.65,7.59 19.26,7.59 17.45,9.4 v13.55,9.4
N$1
  Top 0.305: U$2.37 26.2,24.75 C1.2 26.7,26.65 U$3.1
N$2
  Top 0.305: U3.9 46.1,29.74 45.65,30.19 45.35,30.19 45.15,30.39 R67.1
N$3  (via drill 0.3)
  Top 0.254: v19.45,23.25 13.2,23.25 12.15,24.3 8.3,24.3 6.8,22.8 6.8,20.65 7.6,19.85 8.9,19.85 10.2,18.55 11.7,18.55 13.25,20.1 15.8,20.1 16.35,19.55 v19.45,19.55
  Top 0.305: R2.2 v19.45,19.55 | C8.1 20,22.7 v19.45,23.25
  Bottom 0.305: v19.45,23.25 v19.45,19.55
N$4
  Top 0.305: J4.A5 57.94,26.39 C19.1
N$5
  Top 0.305: J4.B5 54.94,26.46 C18.1
N$6
  Top 0.305: U3.3 48.96,26.84 R17.2
N$7
  Top 0.305: U3.4 49.09,27.34 R19.2
N$9
  Top 0.305: J4.A6 56.94,26.89 56.05,26.89 55.94,27 J4.B6 55.94,29.8 55.45,30.29 52.35,30.29 51.15,29.09 51.15,27.15 R17.1
N$16
  Top 0.305: U$2.38 25.7,24.75 C15.2 25.2,26.75 U$3.2
N$20
  Top 0.305: U$2.7 22.55,18.6 C2.1
N$21
  Top 0.305: R19.1 50.4,29.05 52.14,30.79 56.45,30.79 56.85,30.39 | J4.B7 57.44,29.8 56.85,30.39 | J4.A7 56.44,28.83 56.85,29.24 56.85,30.39
N$22
  Top 0.254: TP1.P$1 30.55,21.6 U$2.30
N$92
  Top 0.305: Q1.5 40.6,11.94 41.05,11.49 41.05,10.89 40.34,10.19 R9.2
N$93
  Top 0.305: Q1.2 41.5,11.94 41.25,12.19 41.25,13.19 42.25,14.2 R11.2
N$96  (via drill 0.35)
  Top 0.305: U6.1 34.64,20.59 v34.45,20.39 | v30.55,30.49 30.55,31.63 CHG1.C
  Bottom 0.305: v34.45,20.39 34.45,21.09 30.55,24.99 v30.55,30.49
N$97
  Top 0.305: R13.2 28.86,31.82 CHG1.A
N$98
  Top 0.406: U6.5 38.3,22.14 R14.2
N$99
  Top 0.305: U4.8 56.11,21.95 C41.2 56.5,23.59 U$27.P$2
N$100
  Top 0.305: U4.9 54.84,22.28 C39.1 54.9,23.79 U$27.P$1
N$101  (via drill 0.35)
  Top 0.254: U4.29 53.57,4.87 50.65,7.79 v50.55,7.79 | v64.75,30.59 64.8,30.55 SW2.A
  Top 0.406: R36.1 64.94,28.56 SW2.A
  Bottom 0.254: v50.55,7.79 58.45,7.79 64.75,14.09 v64.75,30.59
N$103  (via drill 0.35)
  Top 0.406: v50.05,24.89 48.49,23.34 U4.14 | v46.85,33.19 48.31,33.19 POWER1.A
  Bottom 0.406: v50.05,24.89 50.05,25.99 48.05,27.99 46.45,27.99 43.15,31.29 43.15,32.49 43.85,33.19 v46.85,33.19
N$105
  Top 0.305: R37.2 50.66,31.49 POWER1.C
PD_ALM  (via drill 0.35)
  Top 0.254: v31.9,17.7 31.4,17.7 31,18.1 U$2.23 | U4.12 51.03,17.91 53.55,15.39 v53.55,15.19
  Bottom 0.254: v53.55,15.19 53.55,13.39 51.65,11.49 42.35,11.49 41.65,12.19 41.65,12.99 39.25,15.39 38.45,15.39 36.14,17.7 v31.9,17.7
RTS  (via drill 0.35)
  Top 0.254: R11.1 40.55,15.4 v41.35,16.19 | U3.19 44.6,24.34 v44.2,23.94
  Top 0.305: Q1.4 40.17,14.35 R11.1
  Bottom 0.254: v41.35,16.19 41.35,22.39 43,24.04 44.1,24.04 v44.2,23.94
RX
  Top 0.254: U3.20 45.1,23.74 R54.2
RX_ANA_SUP  (via drill 0.3, 0.35)
  Top 0.305: U$2.39 25.2,23.7 v24.75,24.15 24.55,24.35 22.7,24.35 | U$2.33 28.2,23.2 v29.55,24.55 29.55,24.8 C6.1
  Top 0.406: D3.3 16,17 v16.05,17.05 | v14.1,26.45 14.95,27.3 D5.3 15.3,26.65 15.55,26.4 20.65,26.4 22.7,24.35 | C9.1 L4.1 21.71,9.55 v20.75,8.59
  Bottom 0.305: v24.75,24.15 29.15,24.15 v29.55,24.55
  Bottom 0.406: v14.1,26.45 13.5,25.85 13.5,18.45 14.9,17.05 v16.05,17.05 16.05,13.09 20.55,8.59 v20.75,8.59
RX_DIG_SUP  (via drill 0.3, 0.35)
  Top 0.254: v30.95,23.25 30.95,24.3 31.75,25.1
  Top 0.305: U$2.31 30.07,22.38 v30.95,23.25
  Top 0.406: C12.1 18.61,9.63 L3.1 19.66,9.6 20.15,10.09 v20.15,11.69 | C7.1 32.75,26.75 R3.1 31.75,25.1
  Bottom 0.305: 21.8,20.7 23.9,22.8 30.5,22.8 v30.95,23.25
  Bottom 0.406: v20.15,11.69 20.15,19.05 21.8,20.7
SCL  (via drill 0.35)
  Top 0.254: J3.4 43.25,4.29 42.65,3.69 36.25,3.69 v35.55,4.39 | U4.36 62.46,4.38 62.45,4.39 v62.45,4.79
  Top 0.305: R4.1 43.25,6.89 J3.4
  Bottom 0.254: v62.45,4.79 53.65,4.79 53.05,5.39 36.55,5.39 v35.55,4.39 34.55,3.39 31.45,3.39 29.15,5.69 22.98,5.69 SV1.3
SDA  (via drill 0.35)
  Top 0.254: J3.3 42.25,4.69 41.85,4.29 37.45,4.29 v37.15,4.59 | U4.33 58.65,4.09 v58.65,3.99
  Top 0.305: J3.3 42.25,6.79 R5.1
  Bottom 0.254: v58.65,3.99 53.65,3.99 52.72,4.93 37.48,4.93 v37.15,4.59 35.25,2.69 31.25,2.69 28.75,5.19 25.02,5.19 SV1.4
SPO2_CS0  (via drill 0.35)
  Top 0.254: U$2.27 32.46,20.1 34.95,22.59 v35.05,22.59 | U4.10 53.57,21.07 v51.45,23.19
  Bottom 0.254: v35.05,22.59 35.05,23.89 36.65,25.49 47.35,25.49 49.25,23.59 51.05,23.59 v51.45,23.19
SPO2_MISO  (via drill 0.35)
  Top 0.254: U$2.25 32.74,19.1 33.85,17.99 33.85,14.89 v34.25,14.09 | U4.31 56.11,5.56 v56.25,5.69
  Bottom 0.254: v34.25,14.09 35.95,12.79 37.95,12.79 38.95,11.79 38.95,9.79 41.25,7.49 46.75,7.49 47.75,6.49 55.45,6.49 v56.25,5.69
SPO2_MOSI  (via drill 0.35)
  Top 0.254: v34.64,15.19 34.58,15.86 34.58,18.1 33.08,19.6 U$2.26 | U4.37 63.73,4.78 v63.75,4.79
  Bottom 0.254: v63.75,4.79 62.85,5.69 57.95,5.69 56.65,6.99 48.05,6.99 47.05,7.99 41.65,7.99 39.45,10.19 39.45,12.09 38.24,13.3 36.55,13.3 34.66,15.19 v34.64,15.19
SPO2_SCK  (via drill 0.35)
  Top 0.254: U$2.24 32.44,18.6 33.35,17.69 33.35,14.59 v33.15,14.39 | v54.85,5.69 v54.84,5.69 U4.30
  Bottom 0.254: v54.85,5.69 54.65,5.89 47.45,5.89 46.35,6.99 40.95,6.99 38.45,9.49 38.45,11.59 37.75,12.29 34.75,12.29 33.15,13.89 v33.15,14.39
TX
  Top 0.254: U3.21 45.6,24.44 46.45,23.59 R53.2
TX_CTRL_SUP  (via drill 0.3, 0.35)
  Top 0.305: U$2.11 24.12,15.75 v23.35,15.75 22.95,16.15 C4.1
  Top 0.406: C13.1 29.46,10.2 L2.1 29.11,9.55 28.35,8.79 v28.35,8.69
  Bottom 0.406: v28.35,8.69 23.4,13.64 23.4,15.7 v23.35,15.75
TXN
  Top 0.254: U$2.14 26.2,15.7 25.3,14.8 17.2,14.8 16.2,13.8 D2.1
  Top 0.305: D2.1 14.37,13.8 X1.3
TXP
  Top 0.254: U$2.15 26.7,15.4 25.6,14.3 17.75,14.3 D1.1
  Top 0.305: D1.1 13.2,12.2 X1.2
U0RXD
  Top 0.254: U4.34 59.92,4.42 57.85,6.49 53.45,6.49 49.35,10.59 49.35,16.99 46.75,19.59 46.75,22.19 R53.1
U0TXD  (via drill 0.35)
  Top 0.254: U4.35 61.19,4.45 58.55,7.09 53.85,7.09 50.05,10.89 50.05,15.59 v50.15,15.69 | v45.95,21.09 45.35,21.69 R54.1
  Bottom 0.254: v50.15,15.69 45.95,19.89 v45.95,21.09
UART_RX  (via drill 0.35)
  Top 0.254: U4.27 51.03,4.18 v51.05,4.19
  Bottom 0.254: v51.05,4.19 49.05,2.19 30.75,2.19 28.35,4.59 25.75,4.59 24.76,3.6 SV1.5
UART_TX  (via drill 0.35)
  Top 0.254: U4.28 52.3,4.04 v52.25,4.09
  Bottom 0.254: v52.25,4.09 49.75,1.59 28.1,1.59 SV1.6
VBAT
  Top 0.254: R30.2 35.77,15.76 35.77,16.68
  Top 0.406: 35.6,16.51 35.77,16.68 C36.1 35.7,17.1 U6.3 36.24,18.69 36.95,19.39 36.95,22.39 38.15,23.59 39.55,23.59 40.1,24.14 40.1,24.24
  Top 0.61: JP1.2 39.39,24.95 40.1,24.24 41.35,22.99 43.06,22.99 Q2.3
VCM
  Top 0.2: U$2.4 22.55,20.1 R2.1
VIN
  Top 0.406: Q2.2 45,18.3 D11.C 45.05,17.23 C63.1 44.51,16.15 44.05,15.69 42.65,15.69 42.35,15.99 42.35,16.49 41.87,16.98 40.73,16.98 39.45,15.69 39.45,14.49 37.85,12.89 SWIO2.TP 34.46,12.89 U1.1 | U$24.1 34.95,5.64 34.95,8.09 33.95,9.09 33.95,10.79 33.55,11.19 U1.1 | C11.2 32.76,11.35 U1.1

### Text on the board
tPlace: Placement sheet for OpenOx ESP32 | Last Modified : 22-07-21 4.00 pm | STATUS | 07/21 | CHG | GND | +5V | BAT- | BAT+ | BUTTON | protocentral.com | v1.1 | VIN | 3V3 | 3V3 | GND | SCL | SDA | RXO | TXO | OFF | ON | openoximeter.com
bPlace: protocentral.com | 3.7v Li+/LiPoly battery | v1.1 | openoximeter.com | ! 3.3V output only ! | 07/21